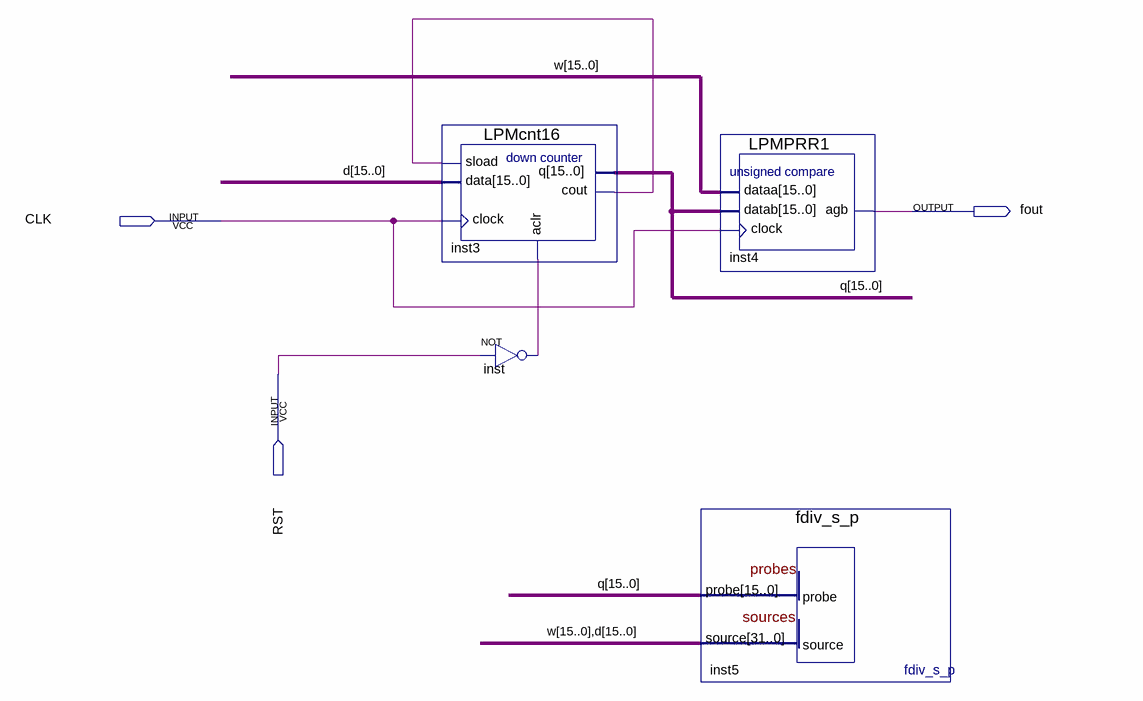
[diagram p0: schematic sheet]
// Quartus schematic lab504LPMPRR.bdf as structural Verilog: 4 symbols, 3 pins
module lab504LPMPRR (
  input  CLK,
  input  RST,
  output fout
);

  wire inst3_cout, inst_out;
  wire [15:0] d, q, w;

  LPMcnt16 inst3 (.sload(inst3_cout), .data(d), .clock(CLK), .aclr(inst_out), .cout(inst3_cout), .q(q));
  not inst (inst_out, RST);
  fdiv_s_p inst5 (.probe(q), .source({w, d}));
  LPMPRR1 inst4 (.dataa(w), .datab(q), .clock(CLK), .agb(fout));
endmodule
